# EAGLE design coaster_v3 (EAGLE 8.7.1)
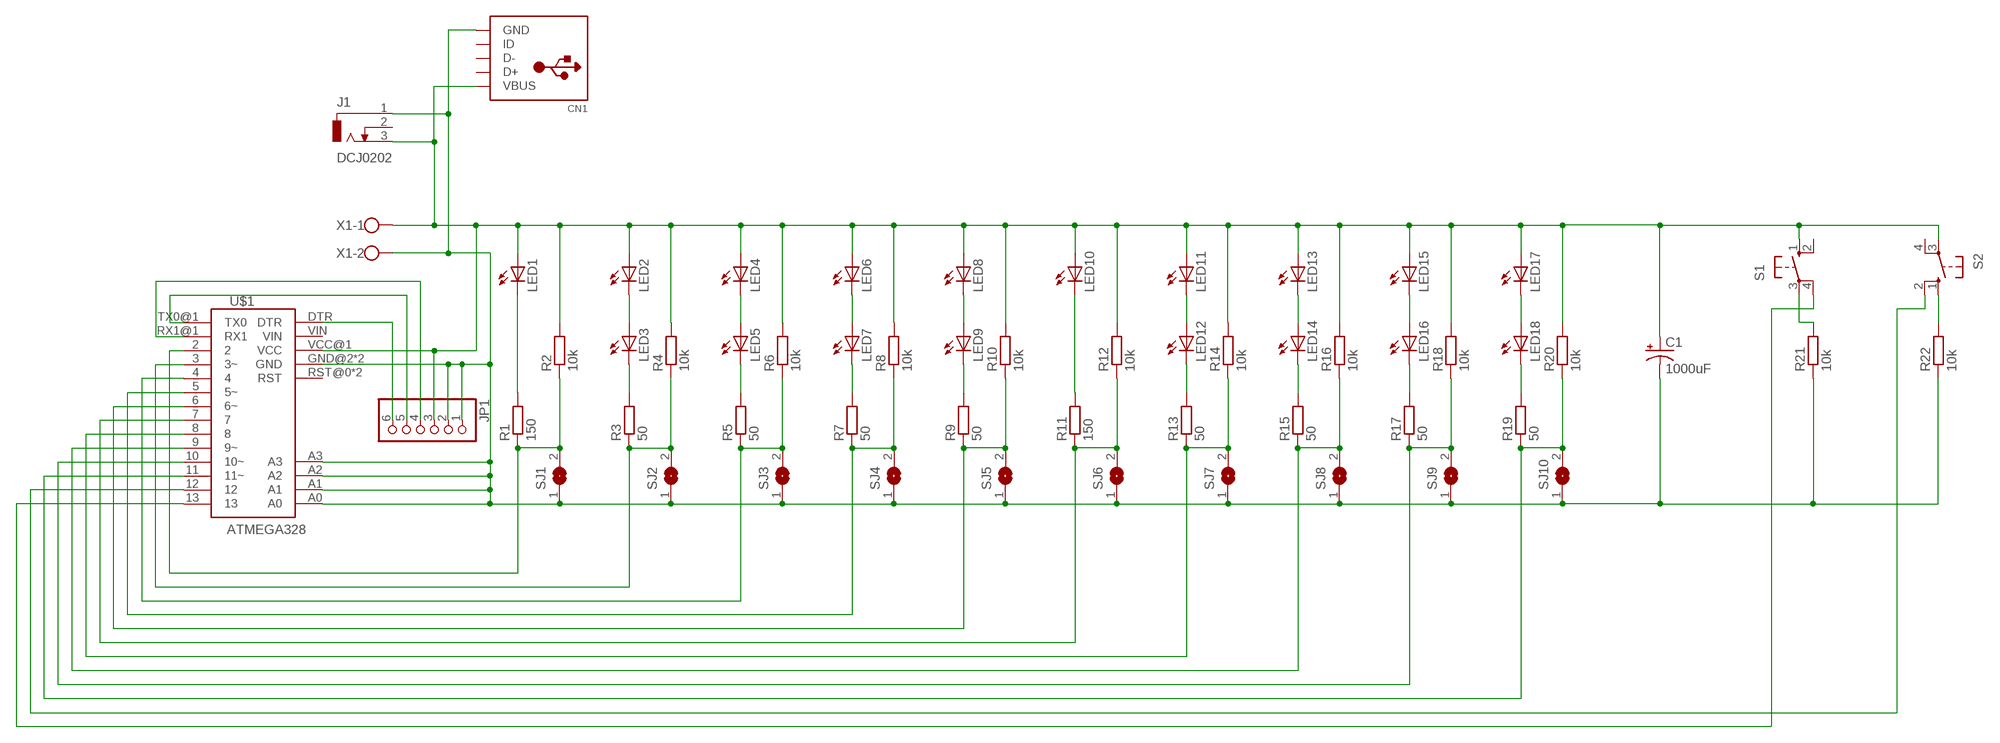
[diagram p0: schematic, sheet 1]

## Parts
C1  1000uF  CPOL-USE3.5-8  [E3,5-8]
CN1  USBTHM  [USB-MINIB-THM]
J1  DCJ0202  [DCJ0202]
JP1  PINHD-1X6  [1X06]
LED1  LED3MM  [LED3MM]
LED2  LED3MM  [LED3MM]
LED3  LED3MM  [LED3MM]
LED4  LED3MM  [LED3MM]
LED5  LED3MM  [LED3MM]
LED6  LED3MM  [LED3MM]
LED7  LED3MM  [LED3MM]
LED8  LED3MM  [LED3MM]
LED9  LED3MM  [LED3MM]
LED10  LED3MM  [LED3MM]
LED11  LED3MM  [LED3MM]
LED12  LED3MM  [LED3MM]
LED13  LED3MM  [LED3MM]
LED14  LED3MM  [LED3MM]
LED15  LED3MM  [LED3MM]
LED16  LED3MM  [LED3MM]
LED17  LED3MM  [LED3MM]
LED18  LED3MM  [LED3MM]
R1  150  R-EU_0207/7  [0207/7]
R2  10k  R-EU_0207/7  [0207/7]
R3  50  R-EU_0207/7  [0207/7]
R4  10k  R-EU_0207/7  [0207/7]
R5  50  R-EU_0207/7  [0207/7]
R6  10k  R-EU_0207/7  [0207/7]
R7  50  R-EU_0207/7  [0207/7]
R8  10k  R-EU_0207/7  [0207/7]
R9  50  R-EU_0207/7  [0207/7]
R10  10k  R-EU_0207/7  [0207/7]
R11  150  R-EU_0207/7  [0207/7]
R12  10k  R-EU_0207/7  [0207/7]
R13  50  R-EU_0207/7  [0207/7]
R14  10k  R-EU_0207/7  [0207/7]
R15  50  R-EU_0207/7  [0207/7]
R16  10k  R-EU_0207/7  [0207/7]
R17  50  R-EU_0207/7  [0207/7]
R18  10k  R-EU_0207/7  [0207/7]
R19  50  R-EU_0207/7  [0207/7]
R20  10k  R-EU_0207/7  [0207/7]
R21  10k  R-EU_0207/7  [0207/7]
R22  10k  R-EU_0207/7  [0207/7]
S1  10-XX  [B3F-10XX]
S2  10-XX  [B3F-10XX]
SJ1  SJW  [SJW]
SJ2  SJW  [SJW]
SJ3  SJW  [SJW]
SJ4  SJW  [SJW]
SJ5  SJW  [SJW]
SJ6  SJW  [SJW]
SJ7  SJW  [SJW]
SJ8  SJW  [SJW]
SJ9  SJW  [SJW]
SJ10  SJW  [SJW]
U$1  ATMEGA328  ATMEGA328-DX172858-LIGHT  [ATMEGA328-DX172858-LIGHT]
X1  W237-102  [W237-102]

## Nets
DTR: JP1.6 U$1.DTR
N$1: LED1.K(C) R1.2
N$2: LED10.K(C) R11.2
N$3: R1.1 R2.1 SJ1.2 U$1.2
N$4: LED2.K(C) LED3.A
N$5: LED3.K(C) R3.2
N$6: R3.1 R4.1 SJ2.2 U$1.3(3~)
N$7: LED4.K(C) LED5.A
N$8: LED5.K(C) R5.2
N$9: R5.1 R6.1 SJ3.2 U$1.4
N$10: R21.2 S1.3(P)
N$11: LED6.K(C) LED7.A
N$12: LED7.K(C) R7.2
N$13: R7.1 R8.1 SJ4.2 U$1.5(5~)
N$14: LED8.K(C) LED9.A
N$15: LED9.K(C) R9.2
N$16: R9.1 R10.1 SJ5.2 U$1.6(6~)
N$17: S2.2(S1) U$1.12
N$18: R11.1 R12.1 SJ6.2 U$1.7
N$19: LED11.K(C) LED12.A
N$20: LED12.K(C) R13.2
N$21: R13.1 R14.1 SJ7.2 U$1.8
N$22: LED13.K(C) LED14.A
N$23: LED14.K(C) R15.2
N$24: R15.1 R16.1 SJ8.2 U$1.9(9~)
N$25: LED15.K(C) LED16.A
N$26: LED16.K(C) R17.2
N$27: R17.1 R18.1 SJ9.2 U$1.10(10~)
N$28: LED17.K(C) LED18.A
N$29: LED18.K(C) R19.2
N$30: R19.1 R20.1 SJ10.2 U$1.11(11~)
N$31: S1.4(P1) U$1.13
N$32: R22.2 S2.1(S)
RXI: JP1.4 U$1.RX1@1(RX1)
TXO: JP1.5 U$1.TX0@1(TX0)
VCC_5V: C1.+ CN1.VBUS J1.3 JP1.3 LED1.A LED2.A LED4.A LED6.A LED8.A LED10.A LED11.A LED13.A LED15.A LED17.A R2.2 R4.2 R6.2 R8.2 R10.2 R12.2 R14.2 R16.2 R18.2 R20.2 S1.1(S) S2.3(P) U$1.VCC@1(VCC) X1.1
VDD_GND: C1.- CN1.GND J1.1 JP1.1 JP1.2 R21.1 R22.1 SJ1.1 SJ2.1 SJ3.1 SJ4.1 SJ5.1 SJ6.1 SJ7.1 SJ8.1 SJ9.1 SJ10.1 U$1.A0 U$1.A1 U$1.A2 U$1.A3 U$1.GND@2(GND) U$1.GND@3(GND) X1.2
Unconnected: CN1.D+ CN1.D- CN1.ID J1.2 S1.2(S1) S2.4(P1) U$1.RST@0(RST) U$1.RST@1(RST) U$1.VIN

## Library data of the parts
C1 = adafruit:CPOL-US: POLARIZED CAPACITOR, American symbol
CN1 = adafruit:USB: USB Connectors USBMINIB - Surface Mount Female Mini-B USB Connector 4UConnector: 06564 By microbuilder.eu Thru-hole RA Female Mini-B USB Connector 4UConnector: 18732 By ladyada.net
J1 = con-jack:DCJ0202: DC POWER JACK Source: DCJ0202.pdf; OC_FARNELL: unknown; OC_NEWARK: unknown
JP1 = adafruit:PINHD-1X6: PIN HEADER
LED1-LED18 = adafruit:LED: LED OSRAM: - CHIPLED LG R971, LG N971, LY N971, LG Q971, LY Q971, LO R971, LY R971 LH N974, LH R974 LS Q976, LO Q976, LY Q976 LO Q996 - Hyper CHIPLED LW Q18S LB Q993, LB Q99A, LB R99A - SideLED LS A670, LO A670, LY A670, LG A670, LP A670 LB A673, LV A673, LT A673, LW A673 LH A674 LY A675 LS A676, LA A676, LO A676, LY A676, LW A676 LS A679, LY A679, LG A679 - Hyper Micro SIDELED® LS Y876, LA Y876, LO Y876, LY Y876 LT Y87S - SmartLED LW L88C, LW L88S LB L89C, LB L89S, LG L890 LS L89K, LO L89K, LY L89K LS L896, LA L896, LO L896, LY L896 - TOPLED LS T670, LO T670, LY T670, LG T670, LP T670 LSG T670, LSP T670, LSY T670, LOP T670, LYG T670 LG T671, LOG T671, LSG T671 LB T673, LV T673, LT T673, LW T673 LH T674 LS T676, LA T676, LO T676, LY T676, LB T676, LH T676, LSB T676, LW T676 LB T67C, LV T67C, LT T67C, LS T67K, LO T67K, LY T67K, LW E67C LS E67B, LA E67B, LO E67B, LY E67B, LB E67C, LV E67C, LT E67C LW T67C LS T679, LY T679, LG T679 LS T770, LO T770, LY T770, LG T770, LP T770 LB T773, LV T773, LT T773, LW T773 LH T774 LS E675, LA E675, LY E675, LS T675 LS T776, LA T776, LO T776, LY T776, LB T776 LHGB T686 LT T68C, LB T68C - Hyper Mini TOPLED® LB M676 - Mini TOPLED Santana® LG M470 LS M47K, LO M47K, LY M47K Source: http://www.osram.convergy.de/
R1-R22 = resistor:R-EU_: RESISTOR, European symbol
S1 S2 = switch-omron:10-XX: OMRON SWITCH; MPN: B3F-1000; OC_FARNELL: 176432; OC_NEWARK: 36M3542
SJ1-SJ10 = jumper:SJ: SMD solder JUMPER
U$1 = custom_components:ATMEGA328-DX172858-LIGHT
X1 = con-wago-500:W237-102: WAGO SCREW CLAMP; MPN: 237-102; OC_FARNELL: unknown; OC_NEWARK: 70K9898

## Board
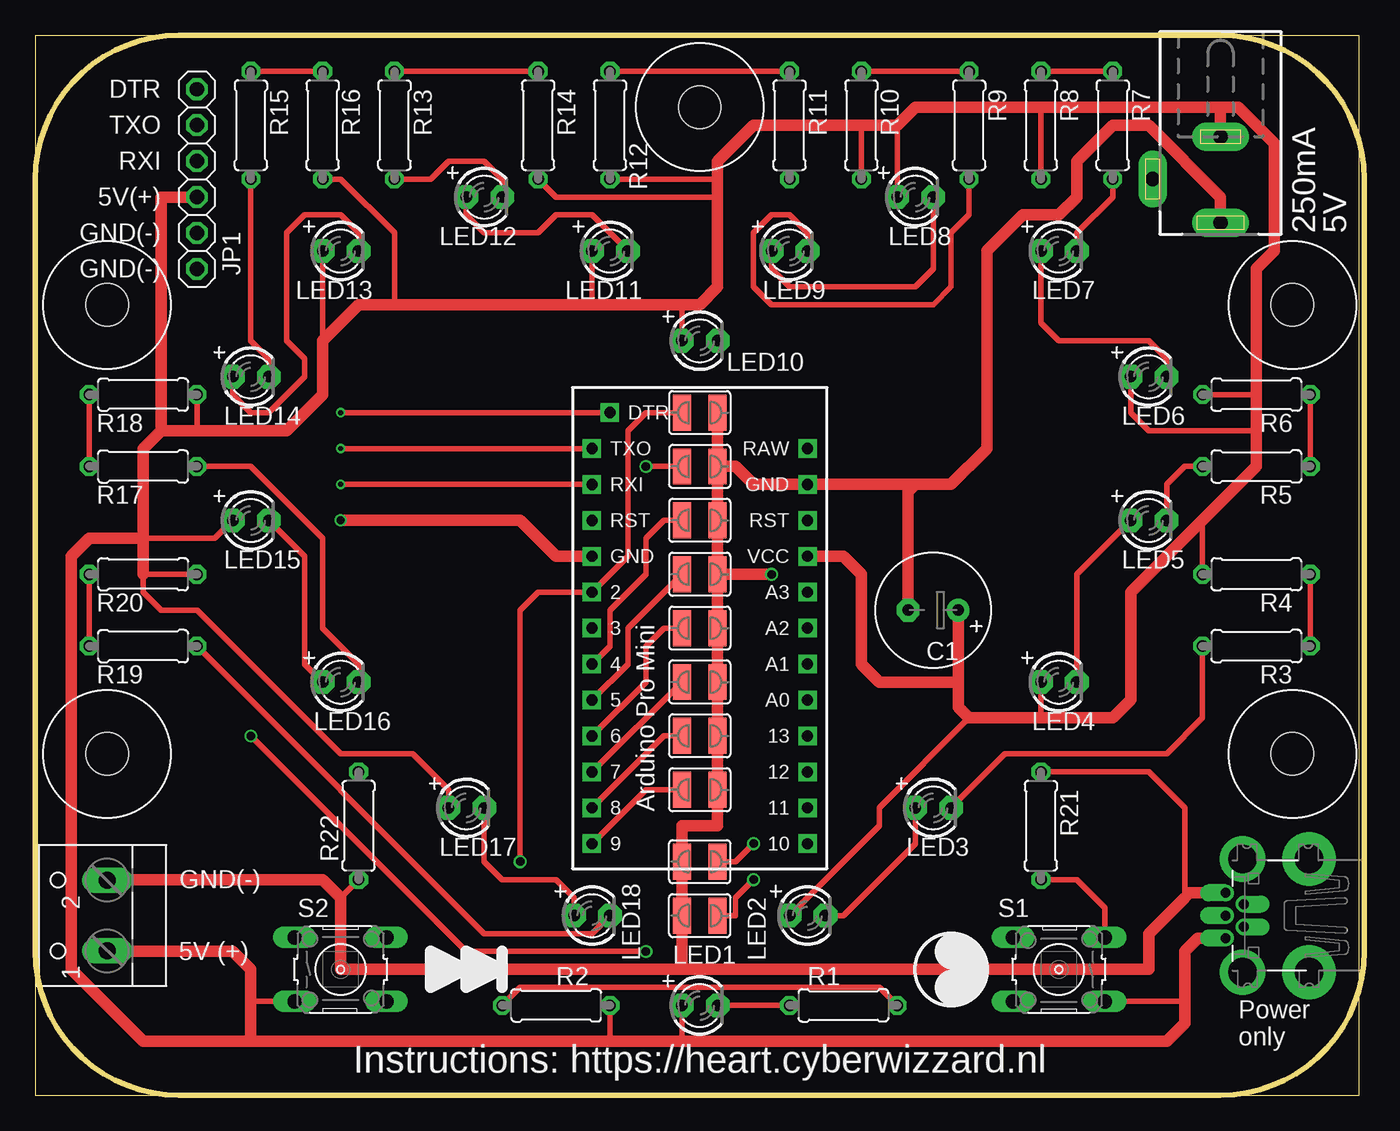
[diagram p1: board, top side]
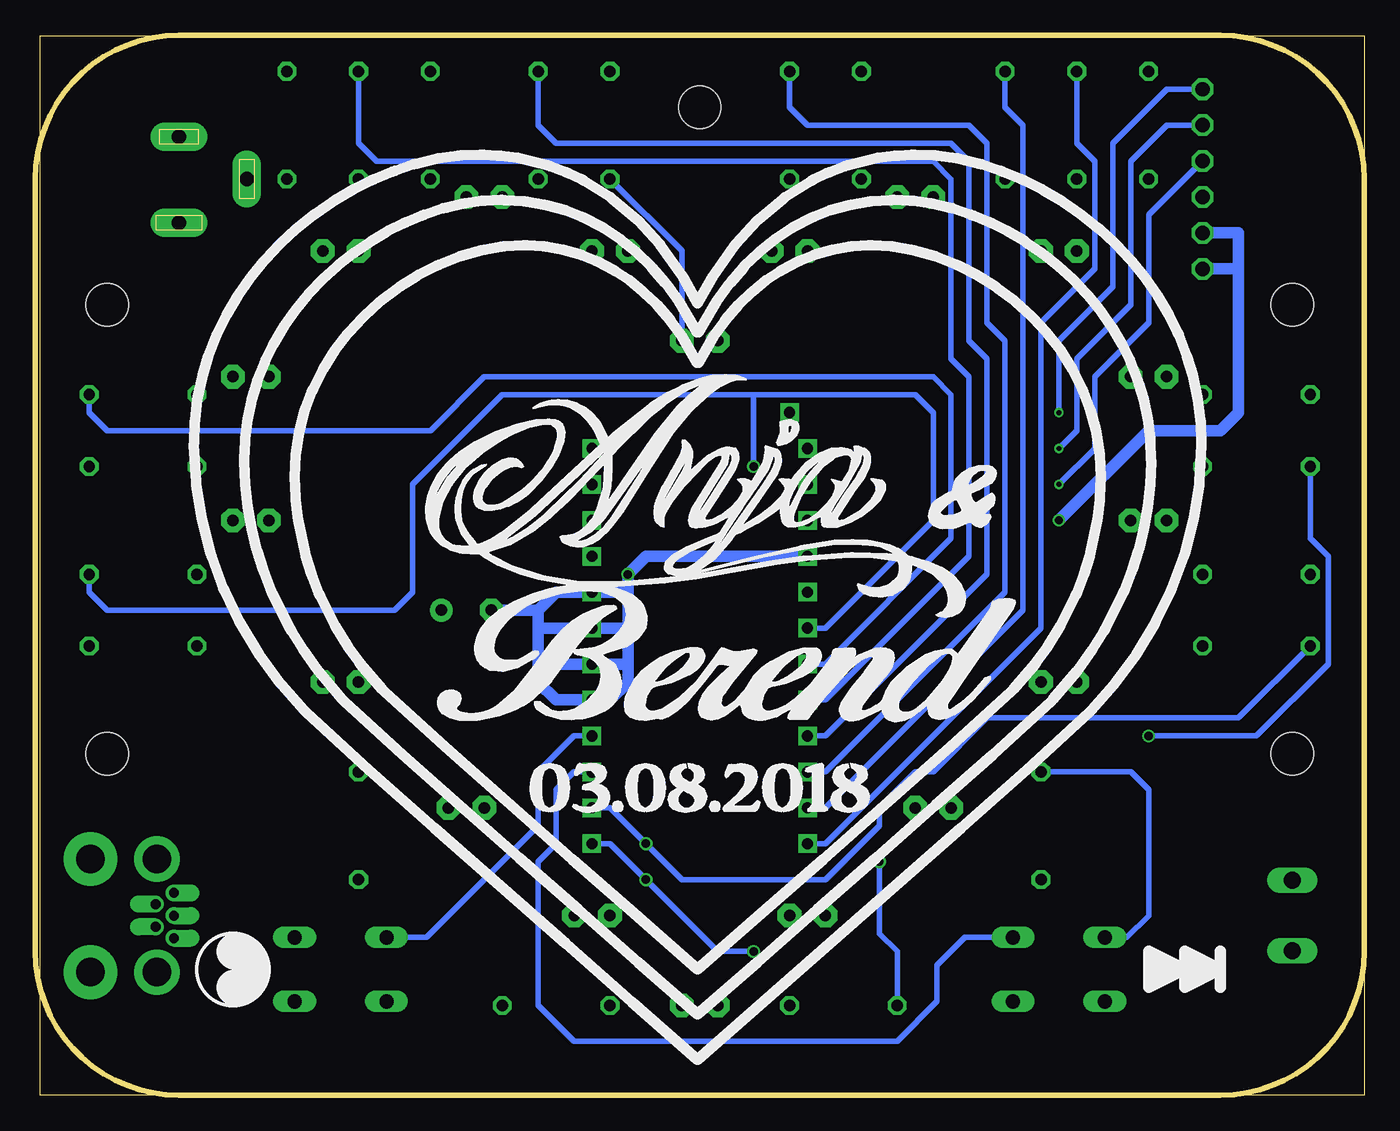
[diagram p2: board, bottom side, seen from below]

Size 93.98 x 74.93 mm. Coordinates in mm from the lower left corner, seen from the top.
Outline: 0,0 93.65,0 93.65,74.92 0,74.92 0,0
Outline: 10.16,0 83.82,0 arc90 93.98,10.16 93.98,64.77 arc90 83.82,74.93 10.16,74.93 arc90 0,64.77 0,10.16 arc90 10.16,0
Copper layers (1*16): Top 0.035mm / dielectric 1.5mm / Bottom 0.035mm
Design rules "SeeedStudio_2layer_DRU_no_angle_20140221 *": minimum track width 6mil, minimum drill 12mil, track to track 6mil, track to pad 6mil, pad to pad 6mil, via to via 6mil, smd to smd 0mil, copper to edge 10mil, drill to drill 10mil, minimum pad ring 10mil, minimum via ring 6mil, stop-mask expansion 2mil, vias tented up to drill 100mil, thermal gap 10mil
Holes 3 mm at 46.99,69.85 5.08,24.13 88.9,24.13 5.08,55.88 88.9,55.88

### Footprints (pad centres in the part's own frame; a part is rotated, then mirrored left to right if it is on the bottom)
E3,5-8 = drill 0.813 pad 1.6: + -1.778,0 | drill 0.813 pad 1.6 octagon: - 1.778,0
USB-MINIB-THM = drill 0.7 offset: D+ 0,9.8; D- -0.8,8.5; GND 1.6,9.8; ID 0.8,8.5; VBUS -1.6,9.8 | drill 2 pad 3.81: GND1 -4,3.9; GND4 4,3.9 | drill 2 pad 3.2: GND2 -4,8.6; GND3 4,8.6
DCJ0202 = drill 1 pad 2 long: 1 0,3.1; 2 4.8,0; 3 0,-3
1X06 = drill 1.016 octagon: 1 -6.35,0; 2 -3.81,0; 3 -1.27,0; 4 1.27,0; 5 3.81,0; 6 6.35,0
LED3MM = drill 0.813 pad 1.676 octagon: A -1.27,0; K 1.27,0
0207/7 = drill 0.813 octagon: 1 -3.81,0; 2 3.81,0
B3F-10XX = drill 1.016 long: 1 -3.251,2.261; 2 3.251,2.261; 3 -3.251,-2.261; 4 3.251,-2.261
SJW = smd 1.27 x 2.54: 1 -1.27,0; 2 1.27,0
ATMEGA328-DX172858-LIGHT = drill 0.8 square: 2 -7.62,2.54; 3 -7.62,0; 4 -7.62,-2.54; 5 -7.62,-5.08; 6 -7.62,-7.62; 7 -7.62,-10.16; 8 -7.62,-12.7; 9 -7.62,-15.24; 10 7.62,-15.24; 11 7.62,-12.7; 12 7.62,-10.16; 13 7.62,-7.62; A0 7.62,-5.08; A1 7.62,-2.54; A2 7.62,0; A3 7.62,2.54; DTR -6.35,15.24; GND@2 -7.62,5.08; GND@3 7.62,10.16; RST@0 -7.62,7.62; RST@1 7.62,7.62; RX1@1 -7.62,10.16; TX0@1 -7.62,12.7; VCC@1 7.62,5.08; VIN 7.62,12.7
W237-102 = drill 1.194 long: 1 -2.5,-1.27; 2 2.5,-1.27

### Placement (x,y rotation side)
C1  63.5,34.29 180 top
CN1  93.98,12.7 90 top
J1  83.82,64.77 180 top
JP1  11.43,64.77 90 top
LED1  46.99,6.35 0 top
LED2  54.61,12.7 0 top
LED3  63.5,20.32 0 top
LED4  72.39,29.21 0 top
LED5  78.74,40.64 0 top
LED6  78.74,50.8 0 top
LED7  72.39,59.69 0 top
LED8  62.23,63.5 0 top
LED9  53.34,59.69 0 top
LED10  46.99,53.34 0 top
LED11  40.64,59.69 0 top
LED12  31.75,63.5 0 top
LED13  21.59,59.69 0 top
LED14  15.24,50.8 0 top
LED15  15.24,40.64 0 top
LED16  21.59,29.21 0 top
LED17  30.48,20.32 0 top
LED18  39.37,12.7 0 top
R1  57.15,6.35 180 top
R2  36.83,6.35 0 top
R3  86.36,31.75 180 top
R4  86.36,36.83 180 top
R5  86.36,44.45 180 top
R6  86.36,49.53 180 top
R7  76.2,68.58 270 top
R8  71.12,68.58 270 top
R9  66.04,68.58 270 top
R10  58.42,68.58 270 top
R11  53.34,68.58 270 top
R12  40.64,68.58 270 top
R13  25.4,68.58 270 top
R14  35.56,68.58 270 top
R15  15.24,68.58 270 top
R16  20.32,68.58 270 top
R17  7.62,44.45 0 top
R18  7.62,49.53 0 top
R19  7.62,31.75 0 top
R20  7.62,36.83 0 top
R21  71.12,19.05 270 top
R22  22.86,19.05 90 top
S1  72.39,8.89 180 top
S2  21.59,8.89 0 top
SJ1  46.99,48.26 180 top
SJ2  46.99,44.45 180 top
SJ3  46.99,40.64 180 top
SJ4  46.99,36.83 180 top
SJ5  46.99,33.02 180 top
SJ6  46.99,29.21 180 top
SJ7  46.99,25.4 180 top
SJ8  46.99,21.59 180 top
SJ9  46.99,12.7 0 top
SJ10  46.99,16.51 0 top
U$1  46.99,33.02 0 top
X1  3.81,12.7 90 top

### Tracks (layer width: path | path; a pad name or v marks a point on that pad's centre or on a via)
DTR  (via drill 0.35)
  Top 0.406: U$1.DTR v21.59,48.26
  Bottom 0.406: v21.59,48.26 21.59,53.34 17.78,57.15 17.78,67.31 13.97,71.12 JP1.6
N$1
  Top 0.406: LED1.K R1.2
N$2
  Bottom 0.406: LED10.K 48.26,59.69 R11.2
N$3  (via drill 0.6)
  Top 0.406: SJ1.2 43.18,48.26 41.91,46.99 41.91,38.1 U$1.2 35.56,35.56 34.29,34.29 v34.29,16.51 | R1.1 59.69,7.62 34.29,7.62 R2.1
  Bottom 0.406: v34.29,16.51 34.29,11.43 33.02,10.16 R2.1
N$4
  Top 0.406: LED3.A 62.23,17.78 57.15,12.7 LED2.K
N$5
  Top 0.406: LED3.K 68.58,24.13 80.01,24.13 82.55,26.67 R3.2
N$6  (via drill 0.6)
  Top 0.406: v43.18,44.45 SJ2.2 | R4.1 R3.1
  Bottom 0.406: 43.18,49.53 60.96,49.53 67.31,43.18 67.31,35.56 68.58,34.29 88.9,34.29 90.17,35.56 R4.1 | 43.18,49.53 31.75,49.53 30.48,48.26 30.48,40.64 38.1,33.02 U$1.3 | 43.18,49.53 v43.18,44.45
N$7
  Top 0.406: LED4.K 73.66,36.83 LED5.A
N$8
  Top 0.406: R5.2 81.28,44.45 80.01,43.18 LED5.K
N$9
  Top 0.406: R6.1 R5.1 | SJ3.2 44.45,40.64 43.18,39.37 43.18,36.83 40.64,34.29 40.64,31.75 U$1.4
  Bottom 0.406: U$1.4 38.1,30.48 29.21,39.37 29.21,49.53 30.48,50.8 62.23,50.8 66.04,46.99 88.9,46.99 90.17,48.26 R6.1
N$10
  Top 0.406: R21.2 73.66,15.24 75.64,13.26 S1.3
N$11
  Top 0.406: LED7.A 71.12,54.61 72.39,53.34 78.74,53.34 80.01,52.07 LED6.K
N$12
  Top 0.406: R7.2 76.2,63.5 73.66,60.96 LED7.K
N$13
  Top 0.406: R8.1 R7.1 | U$1.5 41.91,30.48 41.91,33.02 SJ4.2
  Bottom 0.406: U$1.5 38.1,27.94 27.94,38.1 27.94,50.8 29.21,52.07 29.21,64.77 30.48,66.04 69.85,66.04 71.12,67.31 R8.1
N$14
  Top 0.406: LED9.A 52.07,58.42 53.34,57.15 62.23,57.15 63.5,58.42 LED8.K
N$15
  Top 0.406: R9.2 66.04,62.23 64.77,60.96 64.77,57.15 63.5,55.88 52.07,55.88 50.8,57.15 50.8,60.96 52.07,62.23 53.34,62.23 54.61,60.96 LED9.K
N$16
  Top 0.406: U$1.6 43.18,29.21 43.18,31.75 44.45,33.02 SJ5.2 | R10.1 R9.1
  Bottom 0.406: R10.1 58.42,68.58 57.15,67.31 29.21,67.31 27.94,66.04 27.94,53.34 26.67,52.07 26.67,36.83 38.1,25.4 U$1.6
N$17
  Bottom 0.406: U$1.12 55.88,22.86 57.15,21.59 57.15,17.78 58.42,16.51 58.42,6.35 55.88,3.81 33.02,3.81 30.2,6.63 30.2,9.17 28.22,11.15 S2.2
N$18
  Top 0.406: U$1.7 SJ6.2 | R11.1 R12.1
  Bottom 0.406: R12.1 40.64,69.85 39.37,68.58 27.94,68.58 26.67,67.31 26.67,54.61 25.4,53.34 25.4,35.56 38.1,22.86 U$1.7
N$19
  Top 0.406: LED12.A 30.48,62.23 31.75,60.96 35.56,60.96 36.83,62.23 39.37,62.23 LED11.K
N$20
  Top 0.406: R13.2 27.94,64.77 29.21,66.04 31.75,66.04 33.02,64.77 LED12.K
N$21
  Top 0.406: U$1.8 44.45,25.4 SJ7.2 | R14.1 R13.1
  Bottom 0.406: R13.1 25.4,69.85 24.13,68.58 24.13,34.29 38.1,20.32 U$1.8
N$22
  Top 0.406: LED13.K 22.86,60.96 21.59,62.23 19.05,62.23 17.78,60.96 17.78,53.34 19.05,52.07 19.05,50.8 16.51,48.26 15.24,48.26 13.97,49.53 LED14.A
N$23
  Top 0.406: LED14.K 16.51,52.07 15.24,53.34 R15.2
N$24
  Top 0.406: U$1.9 43.18,21.59 SJ8.2 | R15.1 R16.1
  Bottom 0.406: R16.1 20.32,67.31 19.05,66.04 19.05,58.42 22.86,54.61 22.86,33.02 38.1,17.78 U$1.9
N$25
  Top 0.406: LED16.A 19.05,30.48 19.05,38.1 LED15.K
N$26
  Top 0.406: R17.2 15.24,44.45 20.32,39.37 20.32,33.02 22.86,30.48 LED16.K
N$27  (via drill 0.6)
  Top 0.406: R18.1 R17.1 | v15.24,25.4 30.48,10.16 v43.18,10.16 | SJ9.2 49.53,12.7 49.53,13.97 v50.8,15.24
  Bottom 0.406: R17.1 3.81,39.37 2.54,38.1 2.54,30.48 7.62,25.4 v15.24,25.4 | v43.18,10.16 45.72,10.16 v50.8,15.24 53.34,17.78 U$1.10
N$28
  Top 0.406: LED18.A 38.1,13.97 36.83,15.24 33.02,15.24 31.75,16.51 LED17.K
N$29
  Top 0.406: R19.2 31.75,11.43 39.37,11.43 LED18.K
N$30  (via drill 0.6)
  Top 0.406: R20.1 R19.1 | SJ10.2 49.53,16.51 v50.8,17.78
  Bottom 0.406: R19.1 8.89,26.67 26.67,26.67 30.48,22.86 31.75,22.86 34.29,20.32 34.29,19.05 38.1,15.24 48.26,15.24 v50.8,17.78 53.34,20.32 U$1.11
N$31
  Bottom 0.406: U$1.13 55.88,25.4 58.42,22.86 58.42,19.05 66.32,11.15 S1.4
N$32
  Bottom 0.406: S2.1 16.79,11.15 15.24,12.7 15.24,21.59 16.51,22.86 R22.2
RXI  (via drill 0.35)
  Top 0.406: U$1.RX1@1 v21.59,43.18
  Bottom 0.406: v21.59,43.18 19.05,45.72 19.05,50.8 15.24,54.61 15.24,62.23 JP1.4
TXO  (via drill 0.35)
  Top 0.406: U$1.TX0@1 v21.59,45.72
  Bottom 0.406: v21.59,45.72 20.32,46.99 20.32,52.07 16.51,55.88 16.51,66.04 13.97,68.58 JP1.5
VCC_5V
  Top 0.406: LED2.A 59.69,19.05 59.69,20.32 66.04,26.67 | 20.32,53.34 LED13.A | 58.42,68.58 R10.2 | R8.2 71.12,69.85 | LED8.A 60.96,68.58 | LED10.A 45.72,55.88 | LED11.A 39.37,55.88 | R12.2 48.26,64.77 | 25.4,55.88 25.4,60.96 21.59,64.77 R16.2 | R14.2 36.83,63.5 48.26,63.5 | LED4.A 71.12,26.67 | R4.2 82.55,40.64 | LED6.A 77.47,48.26 78.74,46.99 86.36,46.99 | R6.2 86.36,49.53 | R18.2 11.43,46.99 | R20.2 7.62,36.83 7.62,35.56 8.89,34.29 11.43,34.29 21.59,24.13 26.67,24.13 29.21,21.59 LED17.A | R2.2 40.64,3.81 | LED1.A 45.72,3.81 | LED15.A 12.7,39.37 7.62,39.37 | S1.1 81,6.63 81.28,6.35 | S2.3 15.52,6.63 15.24,6.35
  Top 0.813: 83.82,69.85 85.09,69.85 87.63,67.31 87.63,59.69 86.36,58.42 86.36,49.53 86.36,46.99 86.36,44.45 82.55,40.64 77.47,35.56 77.47,27.94 76.2,26.67 71.12,26.67 66.04,26.67 65.28,27.43 65.28,29.21 | 83.82,69.85 71.12,69.85 62.23,69.85 60.96,68.58 58.42,68.58 50.8,68.58 48.26,66.04 48.26,64.77 48.26,63.5 48.26,57.15 46.99,55.88 45.72,55.88 39.37,55.88 25.4,55.88 22.86,55.88 20.32,53.34 20.32,49.53 17.78,46.99 11.43,46.99 8.89,46.99 | 7.62,39.37 7.62,45.72 8.89,46.99 | 7.62,39.37 7.62,36.83 | X1.1 5.12,10.16 13.97,10.16 15.24,8.89 15.24,6.35 15.24,3.81 | 15.24,3.81 40.64,3.81 45.72,3.81 80.01,3.81 81.28,5.08 81.28,6.35 81.28,10.16 82.22,11.1 CN1.VBUS | 7.62,39.37 3.81,39.37 2.54,38.1 2.54,8.89 7.62,3.81 15.24,3.81 | C1.+ 65.28,29.21 | J1.3 83.82,69.85 | 8.89,46.99 8.89,63.5 JP1.3 | U$1.VCC@1 57.15,38.1 58.42,36.83 58.42,30.48 59.69,29.21 65.28,29.21
VDD_GND  (via drill 0.55, 0.6)
  Top 0.406: R22.1 21.59,13.97 | R21.1 78.74,22.86 81.28,20.32 81.28,13.97
  Top 0.813: SJ4.1 SJ5.1 SJ6.1 SJ7.1 SJ8.1 48.26,19.05 45.72,19.05 SJ10.1 SJ9.1 45.72,8.89 | SJ4.1 SJ3.1 SJ2.1 | SJ2.1 49.53,44.45 50.8,43.18 U$1.GND@3 62.23,43.18 | SJ2.1 SJ1.1 | 45.72,8.89 21.59,8.89 21.59,13.97 20.32,15.24 5.12,15.24 X1.2 | 62.23,43.18 64.77,43.18 67.31,45.72 67.31,59.69 69.85,62.23 72.39,62.23 73.66,63.5 73.66,66.04 76.2,68.58 78.74,68.58 83.82,63.5 J1.1 | v52.07,36.83 SJ4.1 | C1.- 61.72,42.67 62.23,43.18 | CN1.GND 81.61,14.3 81.28,13.97 78.74,11.43 78.74,8.89 45.72,8.89 | U$1.GND@2 36.83,38.1 34.29,40.64 v21.59,40.64
  Bottom 0.813: U$1.GND@2 50.8,38.1 v52.07,36.83 52.07,35.56 | 52.07,35.56 52.07,33.02 | 52.07,33.02 52.07,30.48 | 52.07,30.48 52.07,29.21 53.34,27.94 U$1.A0 57.15,27.94 58.42,29.21 58.42,30.48 | 52.07,30.48 U$1.A1 58.42,30.48 | 52.07,33.02 U$1.A2 58.42,33.02 | 52.07,35.56 U$1.A3 57.15,35.56 58.42,34.29 | C1.- 58.42,34.29 | 58.42,34.29 58.42,33.02 | 58.42,33.02 58.42,30.48 | v21.59,40.64 15.24,46.99 10.16,46.99 8.89,48.26 8.89,58.42 | 8.89,58.42 8.89,60.96 JP1.2 | JP1.1 8.89,58.42

### Text on the board
tNames: DTR | TXO | RXI | 5V(+) | GND(-) | 250mA / 5V | GND(-) | DTR | TXO | RAW | RXI | GND | RST | RST | GND | VCC | 2 | A3 | 3 | A2 | 4 | A1 | 5 | A0 | Arduino Pro Mini | 6 | 13 | 7 | 12 | 8 | 11 | 9 | 10 | GND(-) | 5V (+) | Power / only | Instructions: https://heart.cyberwizzard.nl